# EAGLE design RS485_CV_FT4232H (EAGLE 9.6.2)
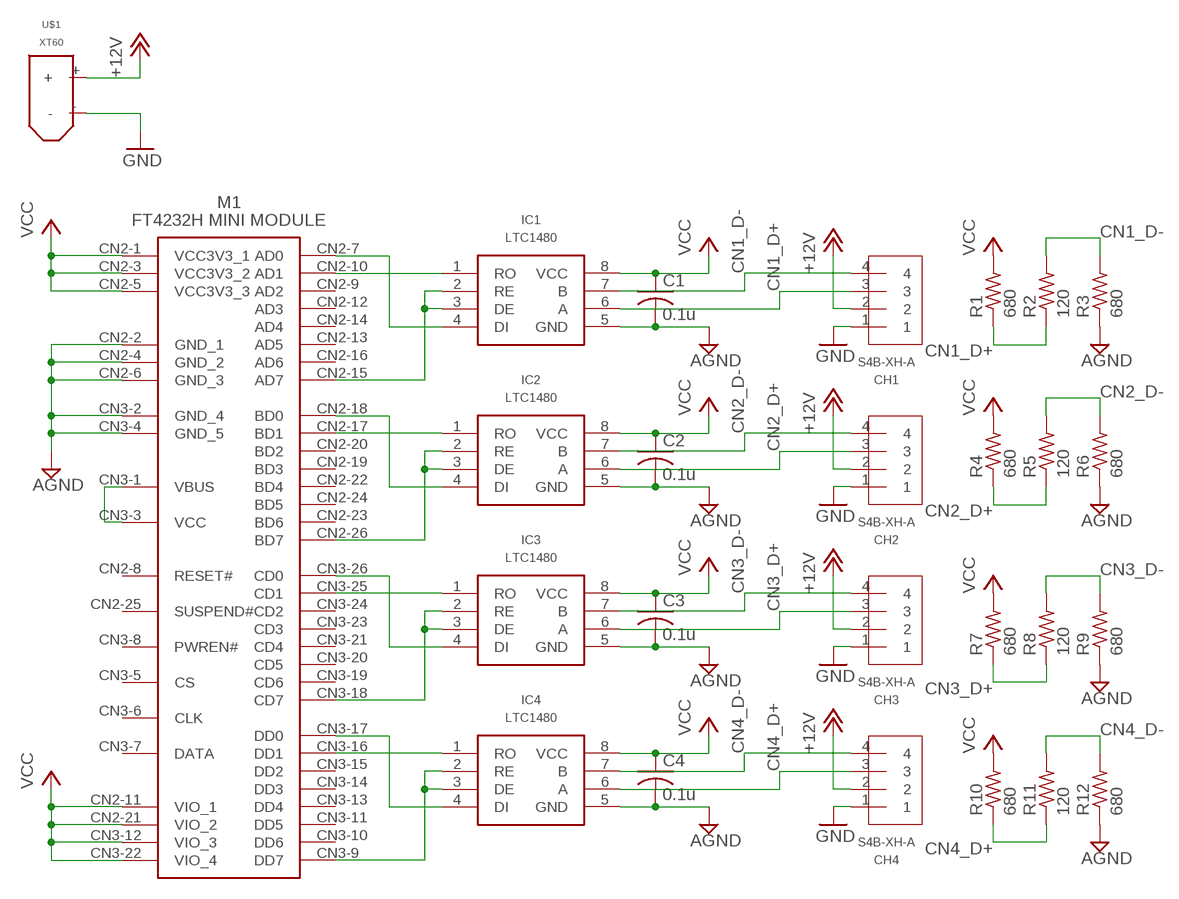
[diagram p0: schematic, sheet 1]

## Parts
C1  0.1u  C-USC0603  [C0603]
C2  0.1u  C-USC0603  [C0603]
C3  0.1u  C-USC0603  [C0603]
C4  0.1u  C-USC0603  [C0603]
CH1  S4B-XH-A  [S4B-XH-A]
CH2  S4B-XH-A  [S4B-XH-A]
CH3  S4B-XH-A  [S4B-XH-A]
CH4  S4B-XH-A  [S4B-XH-A]
IC1  LTC1480  [LTC1480]
IC2  LTC1480  [LTC1480]
IC3  LTC1480  [LTC1480]
IC4  LTC1480  [LTC1480]
M1  FT4232H_MINI_MODULE  [FT4232H_MINI_MODULE]
R1  680  R-US_R0603  [R0603]
R2  120  R-US_R0603  [R0603]
R3  680  R-US_R0603  [R0603]
R4  680  R-US_R0603  [R0603]
R5  120  R-US_R0603  [R0603]
R6  680  R-US_R0603  [R0603]
R7  680  R-US_R0603  [R0603]
R8  120  R-US_R0603  [R0603]
R9  680  R-US_R0603  [R0603]
R10  680  R-US_R0603  [R0603]
R11  120  R-US_R0603  [R0603]
R12  680  R-US_R0603  [R0603]
U$1  XT60PT-M  [XT60PT-M]

## Nets
+12V [PWR]: CH1.2 CH2.2 CH3.2 CH4.2 U$1.+
AGND: C1.2 C2.2 C3.2 C4.2 IC1.5(GND) IC2.5(GND) IC3.5(GND) IC4.5(GND) M1.CN2-2(GND_1) M1.CN2-4(GND_2) M1.CN2-6(GND_3) M1.CN3-2(GND_4) M1.CN3-4(GND_5) R3.1 R6.1 R9.1 R12.1
CN1_D+: CH1.3 IC1.6(A) R1.1 R2.1
CN1_D-: CH1.4 IC1.7(B) R2.2 R3.2
CN2_D+: CH2.3 IC2.6(A) R4.1 R5.1
CN2_D-: CH2.4 IC2.7(B) R5.2 R6.2
CN3_D+: CH3.3 IC3.6(A) R7.1 R8.1
CN3_D-: CH3.4 IC3.7(B) R8.2 R9.2
CN4_D+: CH4.3 IC4.6(A) R10.1 R11.1
CN4_D-: CH4.4 IC4.7(B) R11.2 R12.2
GND [PWR]: CH1.1 CH2.1 CH3.1 CH4.1 U$1.-
N$1: IC1.4(DI) M1.CN2-7(AD0)
N$2: IC1.2(RE) IC1.3(DE) M1.CN2-15(AD7)
N$3: IC2.4(DI) M1.CN2-18(BD0)
N$4: IC2.1(RO) M1.CN2-17(BD1)
N$5: IC3.4(DI) M1.CN3-26(CD0)
N$6: IC3.1(RO) M1.CN3-25(CD1)
N$7: IC4.4(DI) M1.CN3-17(DD0)
N$8: IC4.1(RO) M1.CN3-16(DD1)
N$9: IC1.1(RO) M1.CN2-10(AD1)
N$10: IC2.2(RE) IC2.3(DE) M1.CN2-26(BD7)
N$11: IC3.2(RE) IC3.3(DE) M1.CN3-18(CD7)
N$12: IC4.2(RE) IC4.3(DE) M1.CN3-9(DD7)
N$13: M1.CN3-1(VBUS) M1.CN3-3(VCC)
VCC: C1.1 C2.1 C3.1 C4.1 IC1.8(VCC) IC2.8(VCC) IC3.8(VCC) IC4.8(VCC) M1.CN2-1(VCC3V3_1) M1.CN2-3(VCC3V3_2) M1.CN2-5(VCC3V3_3) M1.CN2-11(VIO_1) M1.CN2-21(VIO_2) M1.CN3-12(VIO_3) M1.CN3-22(VIO_4) R1.2 R4.2 R7.2 R10.2
Unconnected: M1.CN2-8(RESET#) M1.CN2-9(AD2) M1.CN2-12(AD3) M1.CN2-13(AD5) M1.CN2-14(AD4) M1.CN2-16(AD6) M1.CN2-19(BD3) M1.CN2-20(BD2) M1.CN2-22(BD4) M1.CN2-23(BD6) M1.CN2-24(BD5) M1.CN2-25(SUSPEND#) M1.CN3-5(CS) M1.CN3-6(CLK) M1.CN3-7(DATA) M1.CN3-8(PWREN#) M1.CN3-10(DD6) M1.CN3-11(DD5) M1.CN3-13(DD4) M1.CN3-14(DD3) M1.CN3-15(DD2) M1.CN3-19(CD6) M1.CN3-20(CD5) M1.CN3-21(CD4) M1.CN3-23(CD3) M1.CN3-24(CD2)

## Library data of the parts
C1-C4 = rcl:C-US: CAPACITOR, American symbol; SPICEPREFIX: C
CH1-CH4 = JST-XH:S4B-XH-A
IC1-IC4 = LTC1480:LTC1480
M1 = FT4232H_MINI_MODULE:FT4232H_MINI_MODULE
R1-R12 = rcl:R-US_: RESISTOR, American symbol; SPICEPREFIX: R
U$1 = AMASS_XT60:XT60PT-M

## Net classes
0 default: width 0.254 mm
1 PWR: width 3.048 mm

## Board
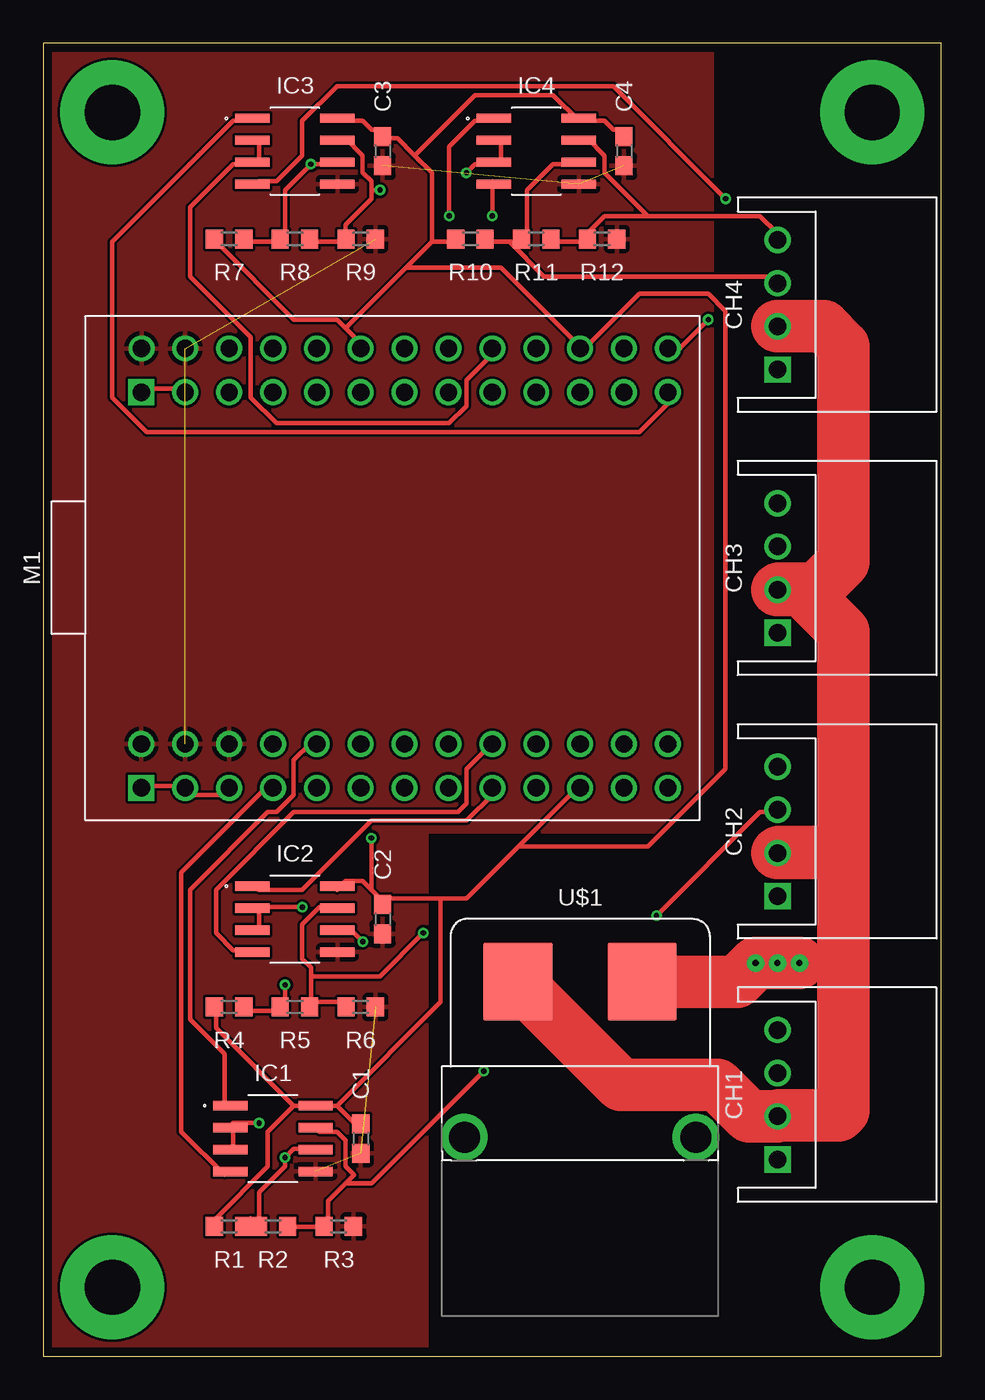
[diagram p1: board, top side]
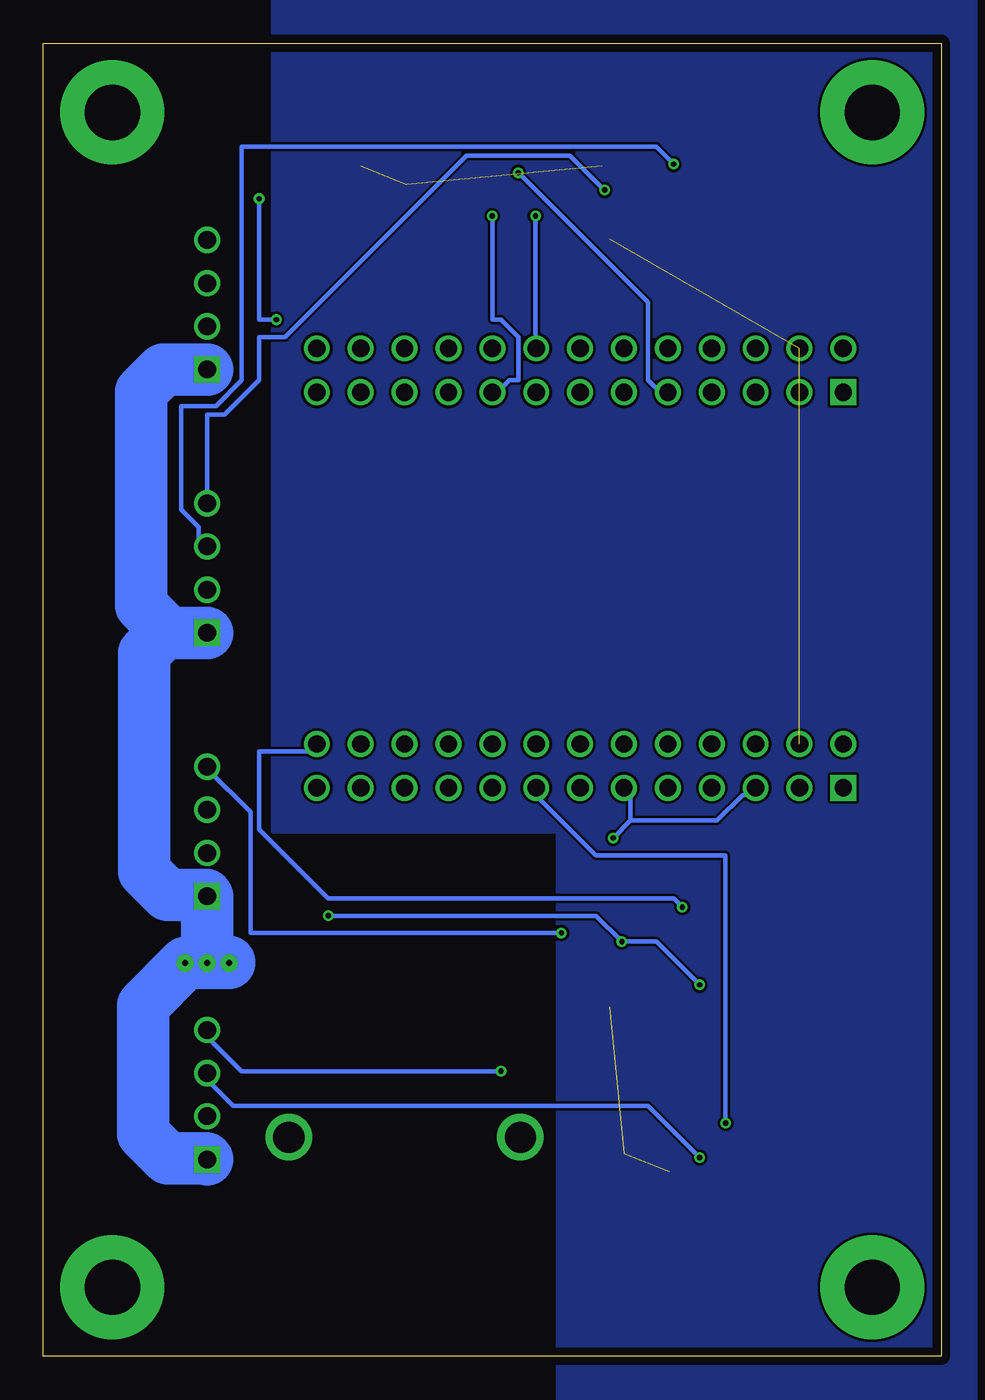
[diagram p2: board, bottom side, seen from below]

Size 52 x 76 mm. Coordinates in mm from the lower left corner, seen from the top.
Outline: 0,0 52,0 52,76 0,76 0,0
Copper layers (1*16): Top 0.035mm / dielectric 1.6mm / Bottom 0.035mm
Design rules "Elecrow_2-layer_PCB_eagle_rule": minimum track width 6mil, minimum drill 12mil, track to track 6mil, track to pad 6mil, pad to pad 6mil, via to via 8mil, smd to smd 0mil, copper to edge 20mil, drill to drill 10mil, minimum pad ring 6mil, minimum via ring 6mil, stop-mask expansion 0mil, vias tented up to drill 100mil, thermal gap 10mil

### Footprints (pad centres in the part's own frame; a part is rotated, then mirrored left to right if it is on the bottom)
C0603 = smd 1.1 x 1: 1 -0.85,0; 2 0.85,0
S4B-XH-A = drill 1.016 square: 1 3.75,0 | drill 1.016: 2 1.25,0; 3 -1.25,0; 4 -3.75,0
LTC1480 = smd 1.981 x 0.533: 1 -2.464,1.905; 2 -2.464,0.635; 3 -2.464,-0.635; 4 -2.464,-1.905; 5 2.464,-1.905; 6 2.464,-0.635; 7 2.464,0.635; 8 2.464,1.905
FT4232H_MINI_MODULE = drill 1 square: CN2-1 -12.715,16.51; CN3-1 10.175,16.51 | drill 1: CN2-2 -10.175,16.51; CN2-3 -12.715,13.97; CN2-4 -10.175,13.97; CN2-5 -12.715,11.43; CN2-6 -10.175,11.43; CN2-7 -12.715,8.89; CN2-8 -10.175,8.89; CN2-9 -12.715,6.35; CN2-10 -10.175,6.35; CN2-11 -12.715,3.81; CN2-12 -10.175,3.81; CN2-13 -12.715,1.27; CN2-14 -10.175,1.27; CN2-15 -12.715,-1.27; CN2-16 -10.175,-1.27; CN2-17 -12.715,-3.81; CN2-18 -10.175,-3.81; CN2-19 -12.715,-6.35; CN2-20 -10.175,-6.35; CN2-21 -12.715,-8.89; CN2-22 -10.175,-8.89; CN2-23 -12.715,-11.43; CN2-24 -10.175,-11.43; CN2-25 -12.715,-13.97; CN2-26 -10.175,-13.97; CN3-2 12.715,16.5; CN3-3 10.175,13.97; CN3-4 12.715,13.97; CN3-5 10.175,11.43; CN3-6 12.715,11.43; CN3-7 10.175,8.89; CN3-8 12.715,8.89; CN3-9 10.175,6.35; CN3-10 12.715,6.35; CN3-11 10.175,3.81; CN3-12 12.715,3.81; CN3-13 10.175,1.27; CN3-14 12.715,1.27; CN3-15 10.175,-1.27; CN3-16 12.715,-1.27; CN3-17 10.175,-3.81; CN3-18 12.715,-3.81; CN3-19 10.175,-6.35; CN3-20 12.715,-6.35; CN3-21 10.175,-8.89; CN3-22 12.715,-8.89; CN3-23 10.175,-11.43; CN3-24 12.715,-11.43; CN3-25 10.175,-13.97; CN3-26 12.715,-13.97
R0603 = smd 1 x 1.1: 1 -0.85,0; 2 0.85,0
XT60PT-M = drill 1.8: 1 -6.7,-1.35; 2 6.7,-1.35 | smd 4 x 4.5: + 3.6,-10.35; - -3.6,-10.35

### Placement (x,y rotation side)
C1  18.38,12.6 270 top
C2  19.65,25.3 270 top
C3  19.65,69.75 270 top
C4  33.62,69.75 270 top
CH1  42.51,15.14 270 top
CH2  42.51,30.38 270 top
CH3  42.51,45.62 270 top
CH4  42.51,60.86 270 top
IC1  13.3,12.6 0 top
IC2  14.57,25.3 0 top
IC3  14.57,69.75 0 top
IC4  28.54,69.75 0 top
M1  22.19,45.62 90 top
R1  10.76,7.52 180 top
R2  13.3,7.52 0 top
R3  17.11,7.52 180 top
R4  10.76,20.22 180 top
R5  14.57,20.22 0 top
R6  18.38,20.22 180 top
R7  10.76,64.67 180 top
R8  14.57,64.67 0 top
R9  18.38,64.67 180 top
R10  24.73,64.67 180 top
R11  28.54,64.67 0 top
R12  32.35,64.67 180 top
U$1  31.08,11.33 180 top

### Tracks (layer width: path | path; a pad name or v marks a point on that pad's centre or on a via)
+12V
  Top 3.048: CH4.2 45.17,59.61 46.32,58.47 46.32,45.96 44.79,44.43 42.57,44.43 CH3.2 42.51,44.35 43.92,44.35 46.32,41.95 46.32,29.45 46.06,29.19 42.57,29.19 CH2.2 46.32,29.13 46.32,14.21 46.06,13.95 42.57,13.95 CH1.2 40.85,13.89 39.03,15.71 33.45,15.71 U$1.+
AGND  (6 unrouted)
  pour Top: -0.67,77.37 -0.67,-1.37 22.19,-1.37 22.19,30.38 38.7,30.38 38.7,77.37
CN1_D+  (via drill 0.3)
  Top 0.254: R1.1 12,8 R2.1 12.5,8 12.5,9.5 14,11 v14,11.5 14.5,12 15.5,12 IC1.6
  Bottom 0.254: v14,11.5 17,14.5 41,14.5 42.5,16 CH1.3
CN1_D-  (via drill 0.3)
  Top 0.254: R2.2 14.5,7.5 16,7.5 R3.2 16.5,8 16.5,9 17.5,10 | 17.5,10 18,10.5 17.5,11 17.5,12.5 17,13 16,13 IC1.7 | v25.5,16.5 19,10 17.5,10
  Bottom 0.254: v25.5,16.5 40.5,16.5 42.5,18.5 CH1.4
CN2_D+  (via drill 0.3)
  Top 0.254: R4.1 12,20 13.5,20 R5.1 14,20.5 v14,21.5 | v18.5,24 18,24.5 17.5,24.5 IC2.6 | v35.5,25.5 41.5,31.5 42.5,31.5 CH2.3
  Bottom 0.254: v14,21.5 16.5,24 v18.5,24 20,25.5 v35.5,25.5
CN2_D-  (via drill 0.3)
  Top 0.254: 15.5,20.5 17.5,20.5 R6.2 | 15.5,22 15.5,22.5 15,23 15,25 16,26 17,26 IC2.7 | 15.5,22 15.5,20.5 | 15.5,20.5 R5.2 | v22,24.5 19.5,22 15.5,22
  Bottom 0.254: v22,24.5 40,24.5 40,31.5 42.5,34 CH2.4
CN3_D+  (via drill 0.3)
  Top 0.254: R7.1 12,64.5 13.5,64.5 R8.1 14,65 14,67.5 v15.5,69 17,69 IC3.6
  Bottom 0.254: v15.5,69 16.5,70 40.5,70 40.5,56.5 42,55 44,55 44,49 43,48 43,47 CH3.3
CN3_D-  (via drill 0.3)
  Top 0.254: R8.2 15.5,64.5 17.5,64.5 R9.2 17.5,65 17.5,65.5 19,67 19,67.5 | 19,67.5 19,68 18.5,68.5 18.5,69.5 17.5,70.5 IC3.7 | 19,67.5 v19.5,67.5
  Bottom 0.254: v19.5,67.5 21.5,69.5 27.5,69.5 38,59 39.5,59 39.5,56.5 41.5,54.5 42.5,54.5 42.5,49.5 CH3.4
CN4_D+
  Top 0.254: 27,64.5 27.5,64.5 R11.1 28,65 28,67.5 29.5,69 31,69 IC4.6 | 27,64.5 26,64.5 R10.1 | 27,64.5 29,62.5 42.5,62.5 CH4.3
CN4_D-
  Top 0.254: R11.2 29.5,64.5 31.5,64.5 R12.2 31.5,65 32.5,66 35,66 | 35,66 41.5,66 42.5,65 CH4.4 | 35,66 32.5,68.5 32.5,69.5 31.5,70.5 IC4.7
GND  (via drill 0.35 pad 1)
  Top 3.048: U$1.- 40.16,21.68 v41.24,22.76 v42.51,22.76 v43.78,22.76
  Bottom 3.048: v42.51,22.76 v41.24,22.76 41.24,22.82 | v42.51,22.76 v43.78,22.76 46.22,20.32 46.22,12.88 44.79,11.45 42.57,11.45 CH1.1 | CH3.1 44.99,41.87 46.16,40.7 46.16,28.06 44.79,26.69 42.57,26.69 CH2.1 42.51,24.09 42.5,23 v42.51,22.76 | CH3.1 43.84,41.87 | CH4.1 45.05,57.11 46.32,55.84 46.32,43.46 44.73,41.87 CH3.1
N$1
  Top 0.254: IC1.4 10.5,10.5 8,13 8,28 13,33 M1.CN2-7
N$2  (via drill 0.3)
  Top 0.254: IC1.3 11,12 11,13 IC1.2 11,13.5 v12.5,13.5
  Bottom 0.254: v12.5,13.5 12.5,29 20,29 23.5,32.5 M1.CN2-15
N$3
  Top 0.254: IC2.4 12,23.5 11,23.5 10,24.5 10,27 14.5,31.5 24,31.5 24.5,32 24.5,34 26,35.5 M1.CN2-18
N$4
  Top 0.254: IC2.1 12.5,27 15,27 19,31 24.5,31 26,32.5 M1.CN2-17
N$5  (via drill 0.3)
  Top 0.254: v39.5,67 33,73.5 17,73.5 15,71.5 15,69.5 13.5,68 12.5,68 IC3.4 | v38.5,60 36.5,58 M1.CN3-26
  Bottom 0.254: v39.5,67 39.5,60 v38.5,60
N$6
  Top 0.254: IC3.1 12,71.5 11,71.5 4,64.5 4,55.5 6,53.5 34.5,53.5 36.5,55.5 M1.CN3-25
N$7  (via drill 0.3)
  Top 0.254: v26,66 26,68 IC4.4
  Bottom 0.254: v26,66 26,60 25.5,60 24.5,59 24.5,56.5 25,56.5 25.5,56 26,56 M1.CN3-17
N$8  (via drill 0.3)
  Top 0.254: v23.5,66 23.5,70 25,71.5 26,71.5 IC4.1
  Bottom 0.254: v23.5,66 23.5,58.5 M1.CN3-16
N$9
  Top 0.254: IC1.1 10.5,14.5 10.5,17.5 8.5,19.5 8.5,27 13,31.5 13.5,31.5 14.5,32.5 14.5,34.5 15.5,35.5 M1.CN2-10
N$10  (via drill 0.3)
  Top 0.254: 12.5,26 12.5,24.5 IC2.3 | v15,26 12.5,26 | 12.5,26 IC2.2
  Bottom 0.254: v15,26 15.5,26.5 35.5,26.5 39.5,30.5 39.5,35 36.5,35 M1.CN2-26
N$11
  Top 0.254: IC3.2 12.5,70.5 12.5,69 IC3.3 12,69 11,69 8.5,66.5 8.5,62.5 12,59 12,55.5 13.5,54 23.5,54 24.5,55 24.5,56.5 26,58 M1.CN3-18
N$12  (via drill 0.3)
  Top 0.254: IC4.2 26.5,70.5 26.5,69 IC4.3 26,69 25,69 v24.5,68.5
  Bottom 0.254: v24.5,68.5 17,61 17,56.5 16.5,56 16,56 M1.CN3-9
N$13
  Top 0.254: M1.CN3-1 6,56 8,56 M1.CN3-3
N$14  (via drill 3.2 pad 6)
  other vias: 4,72
N$15  (via drill 3.2 pad 6)
  other vias: 48,72
N$16  (via drill 3.2 pad 6)
  other vias: 4,4
N$17  (via drill 3.2 pad 6)
  other vias: 48,4
N$18
  pour Bottom: -1.94,78.64 -1.94,-2.64 22.19,-2.64 22.19,30.38 38.7,30.38 38.7,78.64
VCC  (via drill 0.3)
  Top 0.254: C4.1 33.5,71 33,71 32.5,71.5 31.5,71.5 IC4.8 31,71.5 29.5,73 25,73 21.5,69.5 | IC3.8 17.5,71.5 18.5,71.5 19,71 19.5,71 C3.1 20,70.5 20.5,70.5 21.5,69.5 | 17.5,59.5 18.5,58.5 M1.CN3-12 | 17.5,59.5 17,60 14.5,60 10,64.5 R7.2 | 22.5,64.5 23.5,64.5 R10.2 | 17.5,59.5 21,63 | 21,63 22.5,64.5 | 21.5,69.5 22.5,68.5 22.5,64.5 | 21,63 26.5,63 31,58.5 M1.CN3-22 31.5,58.5 34.5,61.5 38.5,61.5 39.5,60.5 39.5,34 35,29.5 27.5,29.5 | 14.5,14.5 13,13 13,11 10,8 R1.2 | 14.5,14.5 15.5,14.5 IC1.8 16,14.5 17,14.5 | 14.5,14.5 10,19 10,20 R4.2 | 17,14.5 18,13.5 C1.1 | M1.CN2-1 6,33 8,33 M1.CN2-3 8.5,32.5 10.5,32.5 M1.CN2-5 | 19,27 18.5,27.5 17.5,27.5 17,27 IC2.8 | 19,27 19.5,26.5 C2.1 20,26.5 23,26.5 | 23,26.5 24.5,26.5 27.5,29.5 | 27.5,29.5 31,33 M1.CN2-21 | 19,27 v19,30 | 17,14.5 23,20.5 23,26.5
  Bottom 0.254: 18,31 18,32.5 M1.CN2-11 | 18,31 13,31 11.5,32.5 11,32.5 M1.CN2-5 | v19,30 18,31